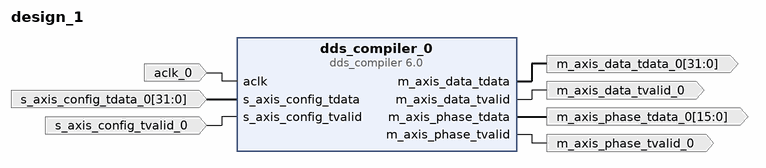
[diagram p0: block diagram of the top level]
# Vivado block design design_1, xc7a100tcsg324-3, Vivado 2018.2
create_bd_design design_1

create_bd_port -dir O -from 31 -to 0 m_axis_data_tdata_0
create_bd_port -dir O m_axis_data_tvalid_0
create_bd_port -dir I -type clk aclk_0
create_bd_port -dir I -from 31 -to 0 s_axis_config_tdata_0
create_bd_port -dir I s_axis_config_tvalid_0
create_bd_port -dir O -from 15 -to 0 m_axis_phase_tdata_0
create_bd_port -dir O m_axis_phase_tvalid_0

create_bd_cell -type ip -vlnv xilinx.com:ip:dds_compiler:6.0 dds_compiler_0
set_property -dict [list \
  CONFIG.PartsPresent Phase_Generator_and_SIN_COS_LUT \
  CONFIG.Parameter_Entry Hardware_Parameters \
  CONFIG.Noise_Shaping None \
  CONFIG.Phase_Width 16 \
  CONFIG.Output_Width 16 \
  CONFIG.Phase_Increment Programmable \
  CONFIG.Phase_offset Programmable \
  CONFIG.Has_Phase_Out true \
  CONFIG.DATA_Has_TLAST Not_Required \
  CONFIG.S_PHASE_Has_TUSER Not_Required \
  CONFIG.M_DATA_Has_TUSER Not_Required \
  CONFIG.Latency 8 \
  CONFIG.Output_Frequency1 0 \
  CONFIG.PINC1 0 \
] [get_bd_cells dds_compiler_0]

# ---- connections ----

connect_bd_net [get_bd_pins dds_compiler_0/m_axis_data_tdata] [get_bd_ports m_axis_data_tdata_0]
connect_bd_net [get_bd_pins dds_compiler_0/m_axis_data_tvalid] [get_bd_ports m_axis_data_tvalid_0]
connect_bd_net -net aclk_0_1 [get_bd_ports aclk_0] [get_bd_pins dds_compiler_0/aclk]
connect_bd_net -net s_axis_config_tdata_0_1 [get_bd_ports s_axis_config_tdata_0] [get_bd_pins dds_compiler_0/s_axis_config_tdata]
connect_bd_net -net s_axis_config_tvalid_0_1 [get_bd_ports s_axis_config_tvalid_0] [get_bd_pins dds_compiler_0/s_axis_config_tvalid]
connect_bd_net [get_bd_pins dds_compiler_0/m_axis_phase_tdata] [get_bd_ports m_axis_phase_tdata_0]
connect_bd_net [get_bd_pins dds_compiler_0/m_axis_phase_tvalid] [get_bd_ports m_axis_phase_tvalid_0]

validate_bd_design
save_bd_design
